# Altium schematic sheet FPGA_Banks_64_65_HR.SchDoc: Sayma AMC
size 420 x 297 mm; $$Internal___BlkDate: 0:12:25_2-9-18; $$Internal_NAME_PLACEHOLDER: a3sheet; $$Internal_Resolution: 00001mm; $$NotCommonProperty_@NAME: FPGA_XCKU040FFVA1156; $$NotCommonProperty_@PRINTORDER: 18; $$NotCommonProperty_@SHEET: FPGA Banks 64 65 HR; $$NotCommonProperty_@SHEETTOTAL: 30; CmpIndex: 990; Drawing Author: G.Kasprowicz; Drawing Number: Sayma AMC; Drawing Project: AMC FMC Carrier Board; Drawing Revision: 2.0; SymIndex: 2141; CheckedBy: P.Kulik,T.Przywozki,W.Ruclo; Author: G.Kasprowicz; CompanyName: WUT ISE; DrawnBy: G.Kasprowicz; Organization: WUT ISE; Address1: PW ISE; Address2: Nowowiejska 15/19 00-665 Warsaw; Address3: gkasprow@gmail.com; DocumentNumber: 26; Revision: 2; SheetNumber: 26; SheetTotal: 32; ModifiedBy: -; CheckedDate: -; Title2: FPGA banks 64 & 65; DivGrp: WUT ISE; Designer: G.Kasprowicz; ModifiedDate: -; ProjectName: Sensor Box
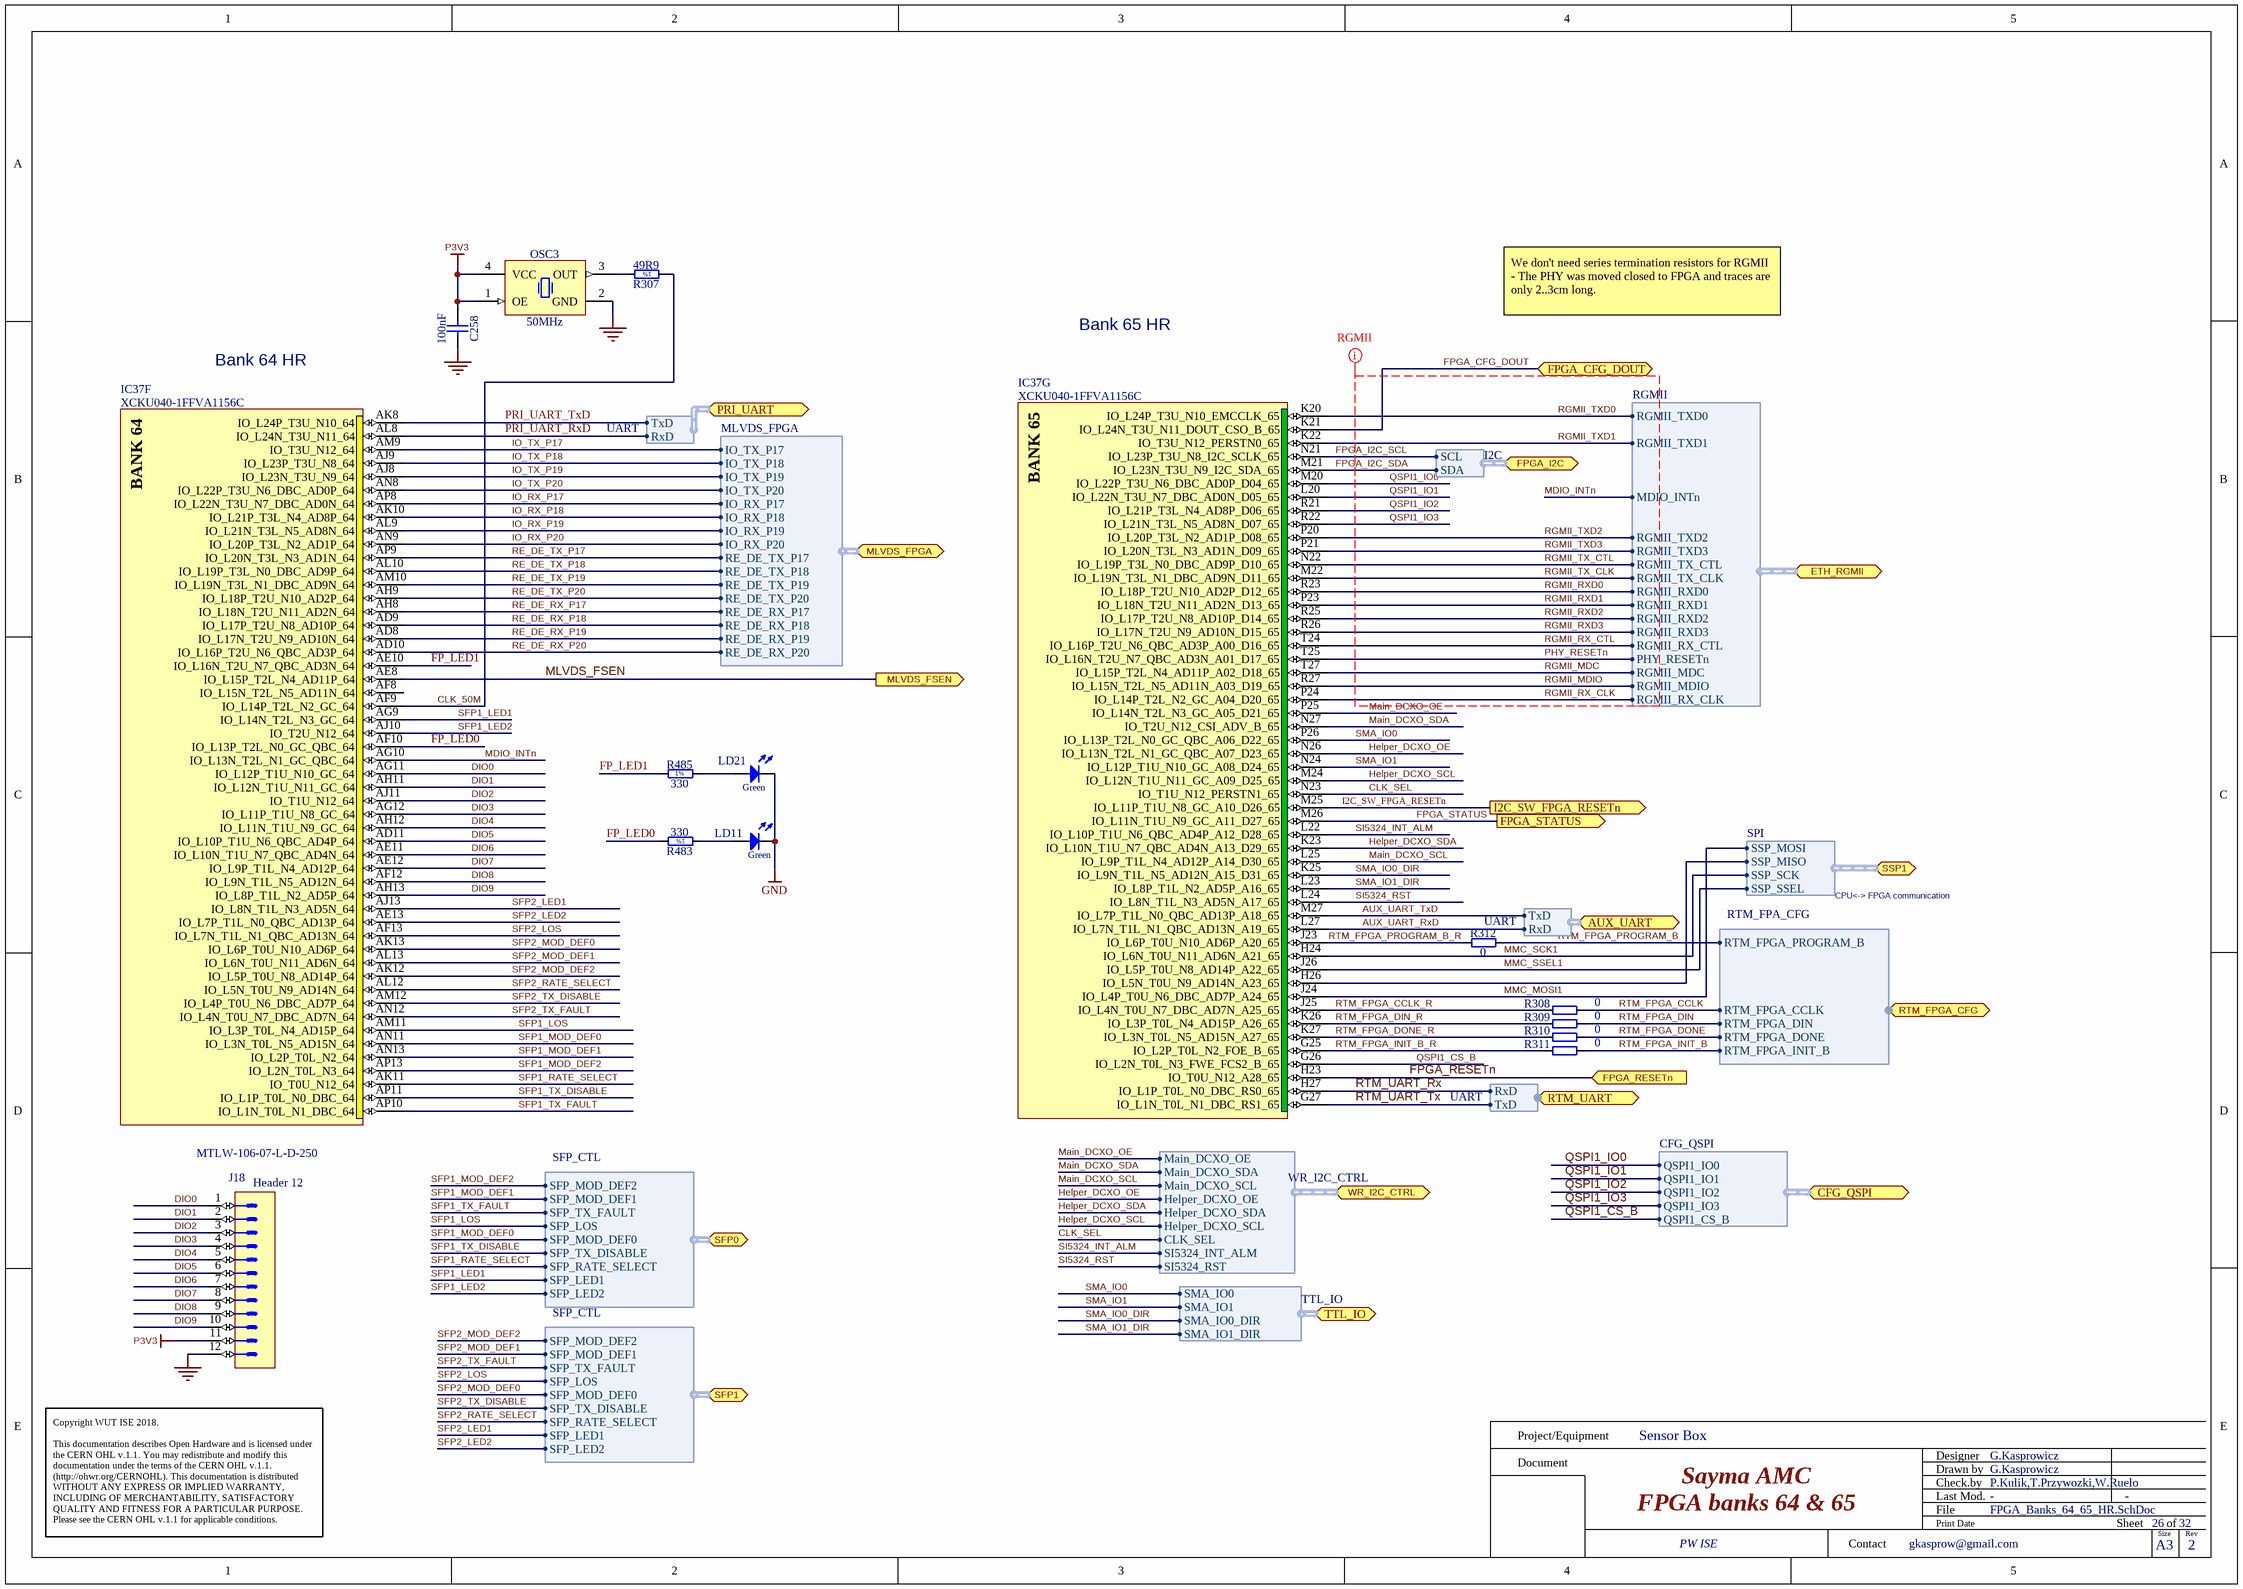
[diagram p0: FPGA_Banks_64_65_HR.SchDoc]

## Parts
C258  100nF  [CAPC0603X33N]
IC37  XCKU040-1FFVA1156C  [BGA1156C100P34X34_3500X3500X350]  (parts F,G of 22)
J18  Header 12  Manufacturer Part Number: MTLW-106-07-L-D-250  [SAMTEC_MTLW-106-07-L-D-250]
LD11  Green  [LED_AVAGO_HSME-C120]
LD21  Green  [LED_KINGBRIGHT_KPH-1608CGCK]
OSC3  50MHz  [OSCSC254P320X500X130-4N]
R307  49R9  [RESC1005X40N]
R308  0  [RESC1005X40N]
R309  0  [RESC1005X40N]
R310  0  [RESC1005X40N]
R311  0  [RESC1005X40N]
R312  0  [RESC1005X40N]
R483  330  [RESC1005X40N]
R485  330  [RESC1005X40N]

## Ports
AUX_UART (bidir, harness UART), CFG_QSPI (bidir, harness CFG_QSPI), ETH_RGMII (bidir, harness RGMII), FPGA_CFG_DOUT (bidir), FPGA_I2C (bidir, harness I2C), FPGA_RESETn (in), FPGA_STATUS (out), I2C_SW_FPGA_RESETn (out), MLVDS_FPGA (bidir, harness MLVDS_FPGA), MLVDS_FSEN (out), PRI_UART (bidir, harness UART), RTM_FPGA_CFG (bidir, harness RTM_FPA_CFG), RTM_UART (bidir, harness UART), SFP0 (bidir, harness SFP_CTL), SFP1 (bidir, harness SFP_CTL), SSP1 (bidir, harness SPI), TTL_IO (bidir, harness TTL_IO), WR_I2C_CTRL (bidir, harness WR_I2C_CTRL)

## Harnesses
SFP_CTL: SFP_MOD_DEF2, SFP_MOD_DEF1, SFP_TX_FAULT, SFP_LOS, SFP_MOD_DEF0, SFP_TX_DISABLE, SFP_RATE_SELECT, SFP_LED1, SFP_LED2
MLVDS_FPGA: IO_TX_P17, IO_RX_P17, IO_RX_P18, IO_RX_P19, IO_RX_P20, IO_TX_P18, IO_TX_P19, IO_TX_P20, RE_DE_TX_P17, RE_DE_TX_P18, RE_DE_TX_P19, RE_DE_TX_P20, RE_DE_RX_P17, RE_DE_RX_P18, RE_DE_RX_P19, RE_DE_RX_P20
I2C: SCL, SDA
SPI: SSP_SCK, SSP_SSEL, SSP_MISO, SSP_MOSI
CFG_QSPI: QSPI1_IO0, QSPI1_IO1, QSPI1_IO2, QSPI1_IO3, QSPI1_CS_B
RTM_FPA_CFG: RTM_FPGA_DIN, RTM_FPGA_CCLK, RTM_FPGA_PROGRAM_B, RTM_FPGA_DONE, RTM_FPGA_INIT_B
UART: RxD, TxD
RGMII: RGMII_RX_CTL, RGMII_RX_CLK, RGMII_RXD3, RGMII_TX_CTL, RGMII_TX_CLK, RGMII_TXD0, RGMII_TXD1, RGMII_TXD2, RGMII_TXD3, RGMII_MDC, RGMII_MDIO, PHY_RESETn, MDIO_INTn, RGMII_RXD0, RGMII_RXD1, RGMII_RXD2
WR_I2C_CTRL: Main_DCXO_OE, Main_DCXO_SDA, Main_DCXO_SCL, Helper_DCXO_OE, Helper_DCXO_SDA, Helper_DCXO_SCL, CLK_SEL, SI5324_INT_ALM, SI5324_RST
TTL_IO: SMA_IO0, SMA_IO1, SMA_IO0_DIR, SMA_IO1_DIR

## Nets
GND: C258.1 J18.12 LD11.1(C) LD21.1(C) OSC3.2(GND)
P3V3: C258.2 J18.11 OSC3.1(OE) OSC3.4(VCC)
AUX_UART_RxD: IC37.L27(IO_L7N_T1L_N1_QBC_AD13N_A19_65) ; port AUX_UART.RxD
AUX_UART_TxD: IC37.M27(IO_L7P_T1L_N0_QBC_AD13P_A18_65) ; port AUX_UART.TxD
CLK_50M: IC37.AF9(IO_L14P_T2L_N2_GC_64) R307.1
CLK_SEL: IC37.N23(IO_T1U_N12_PERSTN1_65) ; port WR_I2C_CTRL.CLK_SEL
DIO0: IC37.AG11(IO_L12P_T1U_N10_GC_64) J18.1
DIO1: IC37.AH11(IO_L12N_T1U_N11_GC_64) J18.2
DIO2: IC37.AJ11(IO_T1U_N12_64) J18.3
DIO3: IC37.AG12(IO_L11P_T1U_N8_GC_64) J18.4
DIO4: IC37.AH12(IO_L11N_T1U_N9_GC_64) J18.5
DIO5: IC37.AD11(IO_L10P_T1U_N6_QBC_AD4P_64) J18.6
DIO6: IC37.AE11(IO_L10N_T1U_N7_QBC_AD4N_64) J18.7
DIO7: IC37.AE12(IO_L9P_T1L_N4_AD12P_64) J18.8
DIO8: IC37.AF12(IO_L9N_T1L_N5_AD12N_64) J18.9
DIO9: IC37.AH13(IO_L8P_T1L_N2_AD5P_64) J18.10
FP_LED0: IC37.AF10(IO_L13P_T2L_N0_GC_QBC_64) R483.2
FP_LED1: IC37.AE10(IO_L16N_T2U_N7_QBC_AD3N_64) R485.1
FPGA_CFG_DOUT: IC37.K21(IO_L24N_T3U_N11_DOUT_CSO_B_65) ; port FPGA_CFG_DOUT
FPGA_I2C_SCL: IC37.N21(IO_L23P_T3U_N8_I2C_SCLK_65) ; port FPGA_I2C.SCL
FPGA_I2C_SDA: IC37.M21(IO_L23N_T3U_N9_I2C_SDA_65) ; port FPGA_I2C.SDA
FPGA_RESETn: IC37.H23(IO_T0U_N12_A28_65) ; port FPGA_RESETn
FPGA_STATUS: IC37.M26(IO_L11N_T1U_N9_GC_A11_D27_65) ; port FPGA_STATUS
Helper_DCXO_OE: IC37.N26(IO_L13N_T2L_N1_GC_QBC_A07_D23_65) ; port WR_I2C_CTRL.Helper_DCXO_OE
Helper_DCXO_SCL: IC37.M24(IO_L12N_T1U_N11_GC_A09_D25_65) ; port WR_I2C_CTRL.Helper_DCXO_SCL
Helper_DCXO_SDA: IC37.K23(IO_L10N_T1U_N7_QBC_AD4N_A13_D29_65) ; port WR_I2C_CTRL.Helper_DCXO_SDA
I2C_SW_FPGA_RESETn: IC37.M25(IO_L11P_T1U_N8_GC_A10_D26_65) ; port I2C_SW_FPGA_RESETn
IO_RX_P17: IC37.AP8(IO_L22N_T3U_N7_DBC_AD0N_64) ; port MLVDS_FPGA.IO_RX_P17
IO_RX_P18: IC37.AK10(IO_L21P_T3L_N4_AD8P_64) ; port MLVDS_FPGA.IO_RX_P18
IO_RX_P19: IC37.AL9(IO_L21N_T3L_N5_AD8N_64) ; port MLVDS_FPGA.IO_RX_P19
IO_RX_P20: IC37.AN9(IO_L20P_T3L_N2_AD1P_64) ; port MLVDS_FPGA.IO_RX_P20
IO_TX_P17: IC37.AM9(IO_T3U_N12_64) ; port MLVDS_FPGA.IO_TX_P17
IO_TX_P18: IC37.AJ9(IO_L23P_T3U_N8_64) ; port MLVDS_FPGA.IO_TX_P18
IO_TX_P19: IC37.AJ8(IO_L23N_T3U_N9_64) ; port MLVDS_FPGA.IO_TX_P19
IO_TX_P20: IC37.AN8(IO_L22P_T3U_N6_DBC_AD0P_64) ; port MLVDS_FPGA.IO_TX_P20
Main_DCXO_OE: IC37.P25(IO_L14N_T2L_N3_GC_A05_D21_65) ; port WR_I2C_CTRL.Main_DCXO_OE
Main_DCXO_SCL: IC37.L25(IO_L9P_T1L_N4_AD12P_A14_D30_65) ; port WR_I2C_CTRL.Main_DCXO_SCL
Main_DCXO_SDA: IC37.N27(IO_T2U_N12_CSI_ADV_B_65) ; port WR_I2C_CTRL.Main_DCXO_SDA
MDIO_INTn: IC37.AG10(IO_L13N_T2L_N1_GC_QBC_64) ; port ETH_RGMII.MDIO_INTn
MLVDS_FSEN: IC37.AE8(IO_L15P_T2L_N4_AD11P_64) ; port MLVDS_FSEN
MMC_MOSI1: IC37.J24(IO_L4P_T0U_N6_DBC_AD7P_A24_65) ; port SSP1.SSP_MOSI
MMC_SCK1: IC37.H24(IO_L6N_T0U_N11_AD6N_A21_65) ; port SSP1.SSP_SCK
MMC_SSEL1: IC37.J26(IO_L5P_T0U_N8_AD14P_A22_65) ; port SSP1.SSP_SSEL
PHY_RESETn: IC37.T25(IO_L16N_T2U_N7_QBC_AD3N_A01_D17_65) ; port ETH_RGMII.PHY_RESETn
PRI_UART_RxD: IC37.AL8(IO_L24N_T3U_N11_64) ; port PRI_UART.RxD
PRI_UART_TxD: IC37.AK8(IO_L24P_T3U_N10_64) ; port PRI_UART.TxD
QSPI1_CS_B: IC37.G26(IO_L2N_T0L_N3_FWE_FCS2_B_65) ; port CFG_QSPI.QSPI1_CS_B
QSPI1_IO0: IC37.M20(IO_L22P_T3U_N6_DBC_AD0P_D04_65) ; port CFG_QSPI.QSPI1_IO0
QSPI1_IO1: IC37.L20(IO_L22N_T3U_N7_DBC_AD0N_D05_65) ; port CFG_QSPI.QSPI1_IO1
QSPI1_IO2: IC37.R21(IO_L21P_T3L_N4_AD8P_D06_65) ; port CFG_QSPI.QSPI1_IO2
QSPI1_IO3: IC37.R22(IO_L21N_T3L_N5_AD8N_D07_65) ; port CFG_QSPI.QSPI1_IO3
RE_DE_RX_P17: IC37.AH8(IO_L18N_T2U_N11_AD2N_64) ; port MLVDS_FPGA.RE_DE_RX_P17
RE_DE_RX_P18: IC37.AD9(IO_L17P_T2U_N8_AD10P_64) ; port MLVDS_FPGA.RE_DE_RX_P18
RE_DE_RX_P19: IC37.AD8(IO_L17N_T2U_N9_AD10N_64) ; port MLVDS_FPGA.RE_DE_RX_P19
RE_DE_RX_P20: IC37.AD10(IO_L16P_T2U_N6_QBC_AD3P_64) ; port MLVDS_FPGA.RE_DE_RX_P20
RE_DE_TX_P17: IC37.AP9(IO_L20N_T3L_N3_AD1N_64) ; port MLVDS_FPGA.RE_DE_TX_P17
RE_DE_TX_P18: IC37.AL10(IO_L19P_T3L_N0_DBC_AD9P_64) ; port MLVDS_FPGA.RE_DE_TX_P18
RE_DE_TX_P19: IC37.AM10(IO_L19N_T3L_N1_DBC_AD9N_64) ; port MLVDS_FPGA.RE_DE_TX_P19
RE_DE_TX_P20: IC37.AH9(IO_L18P_T2U_N10_AD2P_64) ; port MLVDS_FPGA.RE_DE_TX_P20
RGMII_MDC: IC37.T27(IO_L15P_T2L_N4_AD11P_A02_D18_65) ; port ETH_RGMII.RGMII_MDC
RGMII_MDIO: IC37.R27(IO_L15N_T2L_N5_AD11N_A03_D19_65) ; port ETH_RGMII.RGMII_MDIO
RGMII_RX_CLK: IC37.P24(IO_L14P_T2L_N2_GC_A04_D20_65) ; port ETH_RGMII.RGMII_RX_CLK
RGMII_RX_CTL: IC37.T24(IO_L16P_T2U_N6_QBC_AD3P_A00_D16_65) ; port ETH_RGMII.RGMII_RX_CTL
RGMII_RXD0: IC37.R23(IO_L18P_T2U_N10_AD2P_D12_65) ; port ETH_RGMII.RGMII_RXD0
RGMII_RXD1: IC37.P23(IO_L18N_T2U_N11_AD2N_D13_65) ; port ETH_RGMII.RGMII_RXD1
RGMII_RXD2: IC37.R25(IO_L17P_T2U_N8_AD10P_D14_65) ; port ETH_RGMII.RGMII_RXD2
RGMII_RXD3: IC37.R26(IO_L17N_T2U_N9_AD10N_D15_65) ; port ETH_RGMII.RGMII_RXD3
RGMII_TX_CLK: IC37.M22(IO_L19N_T3L_N1_DBC_AD9N_D11_65) ; port ETH_RGMII.RGMII_TX_CLK
RGMII_TX_CTL: IC37.N22(IO_L19P_T3L_N0_DBC_AD9P_D10_65) ; port ETH_RGMII.RGMII_TX_CTL
RGMII_TXD0: IC37.K20(IO_L24P_T3U_N10_EMCCLK_65) ; port ETH_RGMII.RGMII_TXD0
RGMII_TXD1: IC37.K22(IO_T3U_N12_PERSTN0_65) ; port ETH_RGMII.RGMII_TXD1
RGMII_TXD2: IC37.P20(IO_L20P_T3L_N2_AD1P_D08_65) ; port ETH_RGMII.RGMII_TXD2
RGMII_TXD3: IC37.P21(IO_L20N_T3L_N3_AD1N_D09_65) ; port ETH_RGMII.RGMII_TXD3
RTM_FPGA_CCLK: R308.2 ; port RTM_FPGA_CFG.RTM_FPGA_CCLK
RTM_FPGA_CCLK_R: IC37.J25(IO_L4N_T0U_N7_DBC_AD7N_A25_65) R308.1
RTM_FPGA_DIN: R309.2 ; port RTM_FPGA_CFG.RTM_FPGA_DIN
RTM_FPGA_DIN_R: IC37.K26(IO_L3P_T0L_N4_AD15P_A26_65) R309.1
RTM_FPGA_DONE: R310.2 ; port RTM_FPGA_CFG.RTM_FPGA_DONE
RTM_FPGA_DONE_R: IC37.K27(IO_L3N_T0L_N5_AD15N_A27_65) R310.1
RTM_FPGA_INIT_B: R311.2 ; port RTM_FPGA_CFG.RTM_FPGA_INIT_B
RTM_FPGA_INIT_B_R: IC37.G25(IO_L2P_T0L_N2_FOE_B_65) R311.1
RTM_FPGA_PROGRAM_B: R312.2 ; port RTM_FPGA_CFG.RTM_FPGA_PROGRAM_B
RTM_FPGA_PROGRAM_B_R: IC37.J23(IO_L6P_T0U_N10_AD6P_A20_65) R312.1
RTM_UART_Rx: IC37.H27(IO_L1P_T0L_N0_DBC_RS0_65) ; port RTM_UART.RxD
RTM_UART_Tx: IC37.G27(IO_L1N_T0L_N1_DBC_RS1_65) ; port RTM_UART.TxD
SFP1_LED1: IC37.AG9(IO_L14N_T2L_N3_GC_64) ; port SFP0.SFP_LED1
SFP1_LED2: IC37.AJ10(IO_T2U_N12_64) ; port SFP0.SFP_LED2
SFP1_LOS: IC37.AM11(IO_L3P_T0L_N4_AD15P_64) ; port SFP0.SFP_LOS
SFP1_MOD_DEF0: IC37.AN11(IO_L3N_T0L_N5_AD15N_64) ; port SFP0.SFP_MOD_DEF0
SFP1_MOD_DEF1: IC37.AN13(IO_L2P_T0L_N2_64) ; port SFP0.SFP_MOD_DEF1
SFP1_MOD_DEF2: IC37.AP13(IO_L2N_T0L_N3_64) ; port SFP0.SFP_MOD_DEF2
SFP1_RATE_SELECT: IC37.AK11(IO_T0U_N12_64) ; port SFP0.SFP_RATE_SELECT
SFP1_TX_DISABLE: IC37.AP11(IO_L1P_T0L_N0_DBC_64) ; port SFP0.SFP_TX_DISABLE
SFP1_TX_FAULT: IC37.AP10(IO_L1N_T0L_N1_DBC_64) ; port SFP0.SFP_TX_FAULT
SFP2_LED1: IC37.AJ13(IO_L8N_T1L_N3_AD5N_64) ; port SFP1.SFP_LED1
SFP2_LED2: IC37.AE13(IO_L7P_T1L_N0_QBC_AD13P_64) ; port SFP1.SFP_LED2
SFP2_LOS: IC37.AF13(IO_L7N_T1L_N1_QBC_AD13N_64) ; port SFP1.SFP_LOS
SFP2_MOD_DEF0: IC37.AK13(IO_L6P_T0U_N10_AD6P_64) ; port SFP1.SFP_MOD_DEF0
SFP2_MOD_DEF1: IC37.AL13(IO_L6N_T0U_N11_AD6N_64) ; port SFP1.SFP_MOD_DEF1
SFP2_MOD_DEF2: IC37.AK12(IO_L5P_T0U_N8_AD14P_64) ; port SFP1.SFP_MOD_DEF2
SFP2_RATE_SELECT: IC37.AL12(IO_L5N_T0U_N9_AD14N_64) ; port SFP1.SFP_RATE_SELECT
SFP2_TX_DISABLE: IC37.AM12(IO_L4P_T0U_N6_DBC_AD7P_64) ; port SFP1.SFP_TX_DISABLE
SFP2_TX_FAULT: IC37.AN12(IO_L4N_T0U_N7_DBC_AD7N_64) ; port SFP1.SFP_TX_FAULT
SI5324_INT_ALM: IC37.L22(IO_L10P_T1U_N6_QBC_AD4P_A12_D28_65) ; port WR_I2C_CTRL.SI5324_INT_ALM
SI5324_RST: IC37.L24(IO_L8N_T1L_N3_AD5N_A17_65) ; port WR_I2C_CTRL.SI5324_RST
SMA_IO0: IC37.P26(IO_L13P_T2L_N0_GC_QBC_A06_D22_65) ; port TTL_IO.SMA_IO0
SMA_IO0_DIR: IC37.K25(IO_L9N_T1L_N5_AD12N_A15_D31_65) ; port TTL_IO.SMA_IO0_DIR
SMA_IO1: IC37.N24(IO_L12P_T1U_N10_GC_A08_D24_65) ; port TTL_IO.SMA_IO1
SMA_IO1_DIR: IC37.L23(IO_L8P_T1L_N2_AD5P_A16_65) ; port TTL_IO.SMA_IO1_DIR
NetIC37_H26: IC37.H26(IO_L5N_T0U_N9_AD14N_A23_65) ; port SSP1.SSP_MISO
NetLD11_2: LD11.2(A) R483.1
NetLD21_2: LD21.2(A) R485.2
NetOSC3_3: OSC3.3(OUT) R307.2

Not connected (* = marked no-connect by the designer): IC37 AF8(IO_L15N_T2L_N5_AD11N_64)

## Layout directives
net class RGMII: MDIO_INTn, PHY_RESETn, QSPI1_IO0, QSPI1_IO1, QSPI1_IO2, QSPI1_IO3, RGMII_MDC, RGMII_MDIO, RGMII_RX_CLK, RGMII_RX_CTL, RGMII_RXD0, RGMII_RXD1, RGMII_RXD2, RGMII_RXD3, RGMII_TX_CLK, RGMII_TX_CTL, RGMII_TXD0, RGMII_TXD1, RGMII_TXD2, RGMII_TXD3

## Notes on the sheet
- We don't need series termination resistors for RGMII - The PHY was moved closed to FPGA and traces are only 2..3cm long.
- Bank 64 HR
- Bank 65 HR
- CPU<-> FPGA communication
- Project/Equipment
- Document
- Designer
- Drawn by
- Check.by
- Copyright WUT ISE 2018.
  This documentation describes Open Hardware and is licensed under the CERN OHL v.1.1. You may redistribute and modify this documentation under the terms of the CERN OHL v.1.1. (http://ohwr.org/CERNOHL). This documentation is distributed WITHOUT ANY EXPRESS OR IMPLIED WARRANTY, INCLUDING OF MERCHANTABILITY, SATISFACTORY QUALITY AND FITNESS FOR A PARTICULAR PURPOSE. Please see the CERN OHL v.1.1 for applicable conditions.
- Contact
- File
- Last Mod.
- Print Date
- Sheet
- Size
- A3
- of
- Rev
- (in symbol R0402_49R9_1%_0.0625W_100PPM) 1%
- (in symbol R0402_330R_1%_0.0625W_100PPM) 1%
- (in symbol XCKU040-1FFVA1156C, part F) BANK 64
- (in symbol XCKU040-1FFVA1156C, part G) BANK 65

## Library data of the parts
C258 = CC0201_100NF_6.3V_10%_X5R: Non-polarised capacitor; Manufacturer: GENERIC; Part Description: SMD Multilayer Chip Ceramic Capacitor; Manufacturer1 Part Number: 02016D104KAT2A; Tolerance: ±10%; Voltage: 6.3V; TC: X5R; Manufacturer Part Number: CC0201_100NF_6.3V_10%_X5R; Part Number: CC0201_100NF_6.3V_10%_X5R; Value: 100nF; Component Kind: Standard; Component Type: Standard; Pin Count: 2; Status: Not Recommended; Case: 0201; Mounted: Yes; Socket: No; SMD: Yes; Sense: No; Manufacturer1 Example: AVX; Manufacturer1 ComponentHeight: 0.33mm; HelpURL: \\cern.ch\dfs\Applications\Altium\Datasheets\CC0201_X5R_AVX.pdf; Author: CERN DEM JLC; CreateDate: 03.12.2007; LatestRevisionDate: 03.12.2007
IC37 = XCKU040-1FFVA1156C: Kintex UltraScale FPGA, 520 I/O, 530K Cells, 1156-Ball BGA, Speed Grade 1, Commercial Grade; Manufacturer: XILINX; Part Description: Kintex UltraScale, 40 DLL I/O, 416 HP I/O, 104 HR I/O, 1156-Pin BGA, Speed Grade 1, Commercial Grade; PressFit: No; Bonding: No; Manufacturer Part Number: XCKU040-1FFVA1156C; PackageDescription: BGA, 1.00mm Pitch, Square; 1156 Pin, 34 Columns X 34 Rows, Body 35.00mm X 35.00mm X 3.50mm H, IPC Medium Density; Part Number: XCKU040-1FFVA1156C; Component Kind: Standard; Component Type: Standard; Device: XCKU040-1FFVA1156C; Pin Count: 1156; Case: BGA1156; Mounted: Yes; Socket: No; SMD: Yes; Sense: No; ComponentHeight: 3.5mm; HelpURL: \\cern.ch\dfs\Applications\Altium\Datasheets\XCKU040-1FFVA1156C.pdf; ComponentLink1URL: \\cern.ch\dfs\Applications\Altium\Datasheets\XCKU040-1FFVA1156C_Package-Pinout.pdf; ComponentLink1Description: Package/Pinout; Author: CERN DEM CA; CreateDate: 16.08.2016; LatestRevisionDate: 16.08.2016
J18 = SAMTEC_MTLW-106-07-L-D-250: Connector 12 Male; Manufacturer: SAMTEC; Part Description: 12 Contacts, Pitch 2.54mm, Dual Row Through Mount Straight Header (Post Lead = 6.35mm, Tail Lead 3.05mm, Insulator 1.52mm); PressFit: No; Part Number: SAMTEC_MTLW-106-07-L-D-250; Component Kind: Standard; Component Type: Standard; Pin Count: 12; Family: Header 12; Mounted: Yes; Socket: No; Sense: No; SMD: No; Status: None; ComponentHeight: 7.87mm; HelpURL: \\cern.ch\dfs\Applications\Altium\Datasheets\SAMTEC_MTLW-106-07-L-D-250.pdf; Author: CERN DEM JLC; CreateDate: 25.11.2013; LatestRevisionDate: 25.11.2013
LD11 = LED_AVAGO_HSME-C120: LED Green 1C 2A; Manufacturer: AVAGO TECHNOLOGIES; Part Description: High Performance Right Angle Chip Green LED; PressFit: No; Bonding: No; Manufacturer Part Number: HSME-C120; PackageDescription: Green Chip LED, 2-Leads, Body 1.7x1.1mm, Side Emitting Package; Part Number: LED_AVAGO_HSME-C120; Component Kind: Standard; Component Type: Standard; Color: Green; Pin Count: 2; Mounted: Yes; Socket: No; SMD: Yes; Sense: No; ComponentHeight: 0.7mm; HelpURL: \\cern.ch\dfs\Applications\Altium\Datasheets\LED_AVAGO_HSME-C120.pdf; ComponentLink1URL: \\cern.ch\dfs\Applications\Altium\Datasheets\LED_AVAGO_HSME-C110_DESIGN-GUIDE.pdf; ComponentLink1Description: Design Guide; Author: CERN DEM JMW; CreateDate: 22.07.2009; LatestRevisionDate: 20.06.2012
LD21 = LED_KINGBRIGHT_KPH-1608CGCK: LED Green 1C 2A; Part Description: SMD Green LED, Case 1.6mmX0.8mm(0603), 0.65mm Thickness; PressFit: No; Bonding: No; Part Number: LED_KINGBRIGHT_KPH-1608CGCK; Component Kind: Standard; Component Type: Standard; Color: Green; PackageDescription: SMT Green LED, Case 0603, Body L 1.6 x W 0.8mm H 0.65mm; Manufacturer: KINGBRIGHT; Manufacturer Part Number: KPH-1608CGCK; Pin Count: 2; Mounted: Yes; Socket: No; SMD: Yes; Sense: No; ComponentHeight: 0.65mm; HelpURL: \\cern.ch\dfs\Applications\Altium\Datasheets\LED_KINGBRIGHT_KPH-1608CGCK.pdf; Author: CERN DEM JLC; CreateDate: 03.07.2017; LatestRevisionDate: 03.07.2017
OSC3 = OSC_50MHZ_CTS_636L3I050M00000: Oscillator 4 pins 1=OE 2=GND 3=OUT 4=VCC; Manufacturer: CTS ELECTRONIC COMPONENTS; Part Description: 3.3V, ±50ppm, 30pF, -40..85°C, HCMOS/TTL Clock Oscillator, 636 Series; PressFit: No; Bonding: No; Manufacturer Part Number: 636L3I050M00000; PackageDescription: Oscillator, Side Concave; 2.54mm Pitch; 4 pin, 3.20mm L X 5.00mm W X 1.30mm H, IPC Medium Density; Part Number: OSC_50MHZ_CTS_636L3I050M00000; Value: 50MHz; Component Kind: Standard; Component Type: Standard; Pin Count: 4; Mounted: Yes; Socket: No; SMD: Yes; Sense: No; ComponentHeight: 1.3mm; HelpURL: \\cern.ch\dfs\Applications\Altium\Datasheets\OSC_CTS_636.pdf; Author: CERN DEM JMW; CreateDate: 22.09.2015; LatestRevisionDate: 22.09.2015
R307 = R0402_49R9_1%_0.0625W_100PPM: Resistor - 1%; Manufacturer: GENERIC; Part Description: General Purpose Thick Film Chip Resistor; Manufacturer1 Part Number: 232270674999L or RC0402FR-0749R9L; TC: ±100ppm/°C; PressFit: No; Manufacturer Part Number: R0402_49R9_1%_0.0625W_100PPM; Part Number: R0402_49R9_1%_0.0625W_100PPM; Tolerance: ±1%; Value: 49R9; Component Kind: Standard; Component Type: Standard; Pin Count: 2; Status: Not Recommended; Power: 0.0625W; Case: 0402; Mounted: Yes; Sense: No; Socket: No; SMD: Yes; Manufacturer1 Example: YAGEO PHYCOMP; Manufacturer1 ComponentHeight: 0.4mm; HelpURL: \\cern.ch\dfs\Applications\Altium\Datasheets\R0402_Phycomp_RC0402.pdf; Author: CERN DEM JLC; CreateDate: 24.10.2012; LatestRevisionDate: 24.10.2012
R308-R312 = R0402_0R_JUMPER: Resistor; Manufacturer: GENERIC; Part Description: 1A (0.05R Max DC Resistance) Zero Ohm Jumper; Manufacturer1 Part Number: 232270591001L; PressFit: No; Manufacturer Part Number: R0402_0R_JUMPER; Part Number: R0402_0R_JUMPER; Value: 0; Component Kind: Standard; Component Type: Standard; Pin Count: 2; Status: Not Recommended; Case: 0402; Mounted: Yes; Sense: No; Socket: No; SMD: Yes; Manufacturer1 Example: YAGEO PHYCOMP; Manufacturer1 ComponentHeight: 0.4mm; HelpURL: \\cern.ch\dfs\Applications\Altium\Datasheets\R0402_Phycomp_RC0402.pdf; Author: CERN DEM JLC; CreateDate: 03.12.2007; LatestRevisionDate: 17.10.2012
R483 R485 = R0402_330R_1%_0.0625W_100PPM: Resistor - 1%; Manufacturer: GENERIC; Part Description: General Purpose Thick Film Chip Resistor; Manufacturer1 Part Number: 232270673301L; TC: ±100ppm/°C; PressFit: No; Manufacturer Part Number: R0402_330R_1%_0.0625W_100PPM; Part Number: R0402_330R_1%_0.0625W_100PPM; Tolerance: ±1%; Value: 330; Component Kind: Standard; Component Type: Standard; Pin Count: 2; Status: Not Recommended; Power: 0.0625W; Case: 0402; Mounted: Yes; Sense: No; Socket: No; SMD: Yes; Manufacturer1 Example: YAGEO PHYCOMP; Manufacturer1 ComponentHeight: 0.4mm; HelpURL: \\cern.ch\dfs\Applications\Altium\Datasheets\R0402_Phycomp_RC0402.pdf; Author: CERN DEM JLC; CreateDate: 03.12.2007; LatestRevisionDate: 17.10.2012